# Altium schematic sheet audiorigth.SchDoc
size A
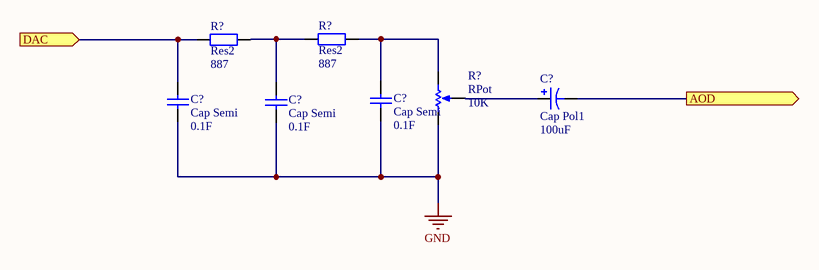
[diagram p0: audiorigth.SchDoc]

## Parts
(Parts that share a designator on the sheet are numbered #1, #2 ... from top to bottom, then left to right.)
C?#1  Cap Pol1  value 100uF  [RB7.6-15]
C?#2  Cap Semi  value 0.1F  [C2512]
C?#3  Cap Semi  value 0.1F  [C2512]
C?#4  Cap Semi  value 0.1F  [C2512]
R?#1  Res2  value 887  [AXIAL-0.4]
R?#2  Res2  value 887  [AXIAL-0.4]
R?#3  RPot  value 10K  [VR5]

## Ports
AOD (out), DAC (in)

## Nets
GND: C?#2.1 C?#3.1 C?#4.1 R?#3.1(TOP)
AOD: C?#1.2 ; port AOD
DAC: C?#2.2 R?#1.1 ; port DAC
NetC?#1_1: C?#1.1 R?#3.3(TAP)
NetC?#3_2: C?#3.2 R?#1.2 R?#2.1
NetC?#4_2: C?#4.2 R?#2.2 R?#3.2(BOT)

## Library data of the parts
C?#1 = Cap Pol1: Polarized Capacitor (Radial); Constructeur: PANASONIC; Ref constructeur: EEUFM1E101; Vendeur: Farnell
C?#2-C?#4 = Cap Semi: Capacitor (Semiconductor SIM Model); Vendeur: Farnell; Fabricant: KEMET; Ref Fabricant: FG0H104ZF
R?#1 R?#2 = Res2: Resistor; Fabricant: VISHAY BC COMPONENTS; Ref Fabricant: MRS25000C8870FCT00; Vendeur: Farnell
R?#3 = RPot: Potentiometer; Fabricant: TE CONNECTIVITY / CITEC; Ref Fabricant: CP16SH10IP06103F; Vendeur: Farnell